# Altium project GateWay V1.2.PrjPCB
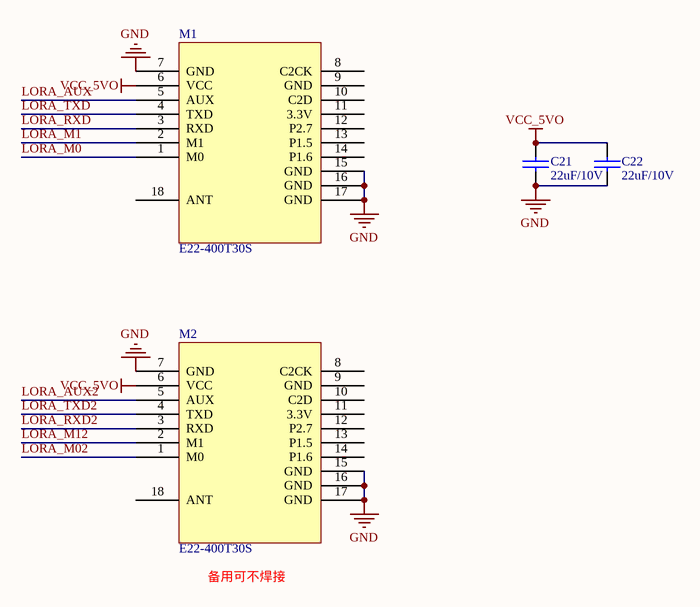
[diagram p0: LORA.SchDoc]
4 sheets, 92 parts. Net scope: global (net labels, ports and power ports of the same name join across sheets).
Board file: GateWay V1.2.PcbDoc
Sheets:
  LORA.SchDoc
  nbiot&gps.SchDoc
  POWER.SchDoc
  rs485.SchDoc

## Sheet LORA.SchDoc
size A4

### Parts
C21  22uF/10V  [1206C]
C22  22uF/10V  [1206C]
M1  E22-400T30S  [E22-400T30S]
M2  E22-400T30S  [E22-400T30S]

### Nets
GND: C21.2 C22.2 M1.7(GND) M1.15(GND) M1.16(GND) M1.17(GND) M2.7(GND) M2.15(GND) M2.16(GND) M2.17(GND)  [project net AGND]
VCC_5VO: C21.1 C22.1 M1.6(VCC) M2.6(VCC)  [project net VCC_5V]
LORA_AUX: M1.5(AUX)
LORA_AUX2: M2.5(AUX)
LORA_M0: M1.1(M0)
LORA_M1: M1.2(M1)
LORA_M02: M2.1(M0)
LORA_M12: M2.2(M1)
LORA_RXD: M1.3(RXD)
LORA_RXD2: M2.3(RXD)
LORA_TXD: M1.4(TXD)
LORA_TXD2: M2.4(TXD)

Not connected (* = marked no-connect by the designer): M1 8(C2CK) 9(GND) 10(C2D) 11(3.3V) 12(P2.7) 13(P1.5) 14(P1.6) 18(ANT); M2 8(C2CK) 9(GND) 10(C2D) 11(3.3V) 12(P2.7) 13(P1.5) 14(P1.6) 18(ANT)

### Notes on the sheet
- 备用可不焊接

### Library data of the parts
C21 C22 = CAP: Capacitor

## Sheet nbiot&gps.SchDoc
size A3
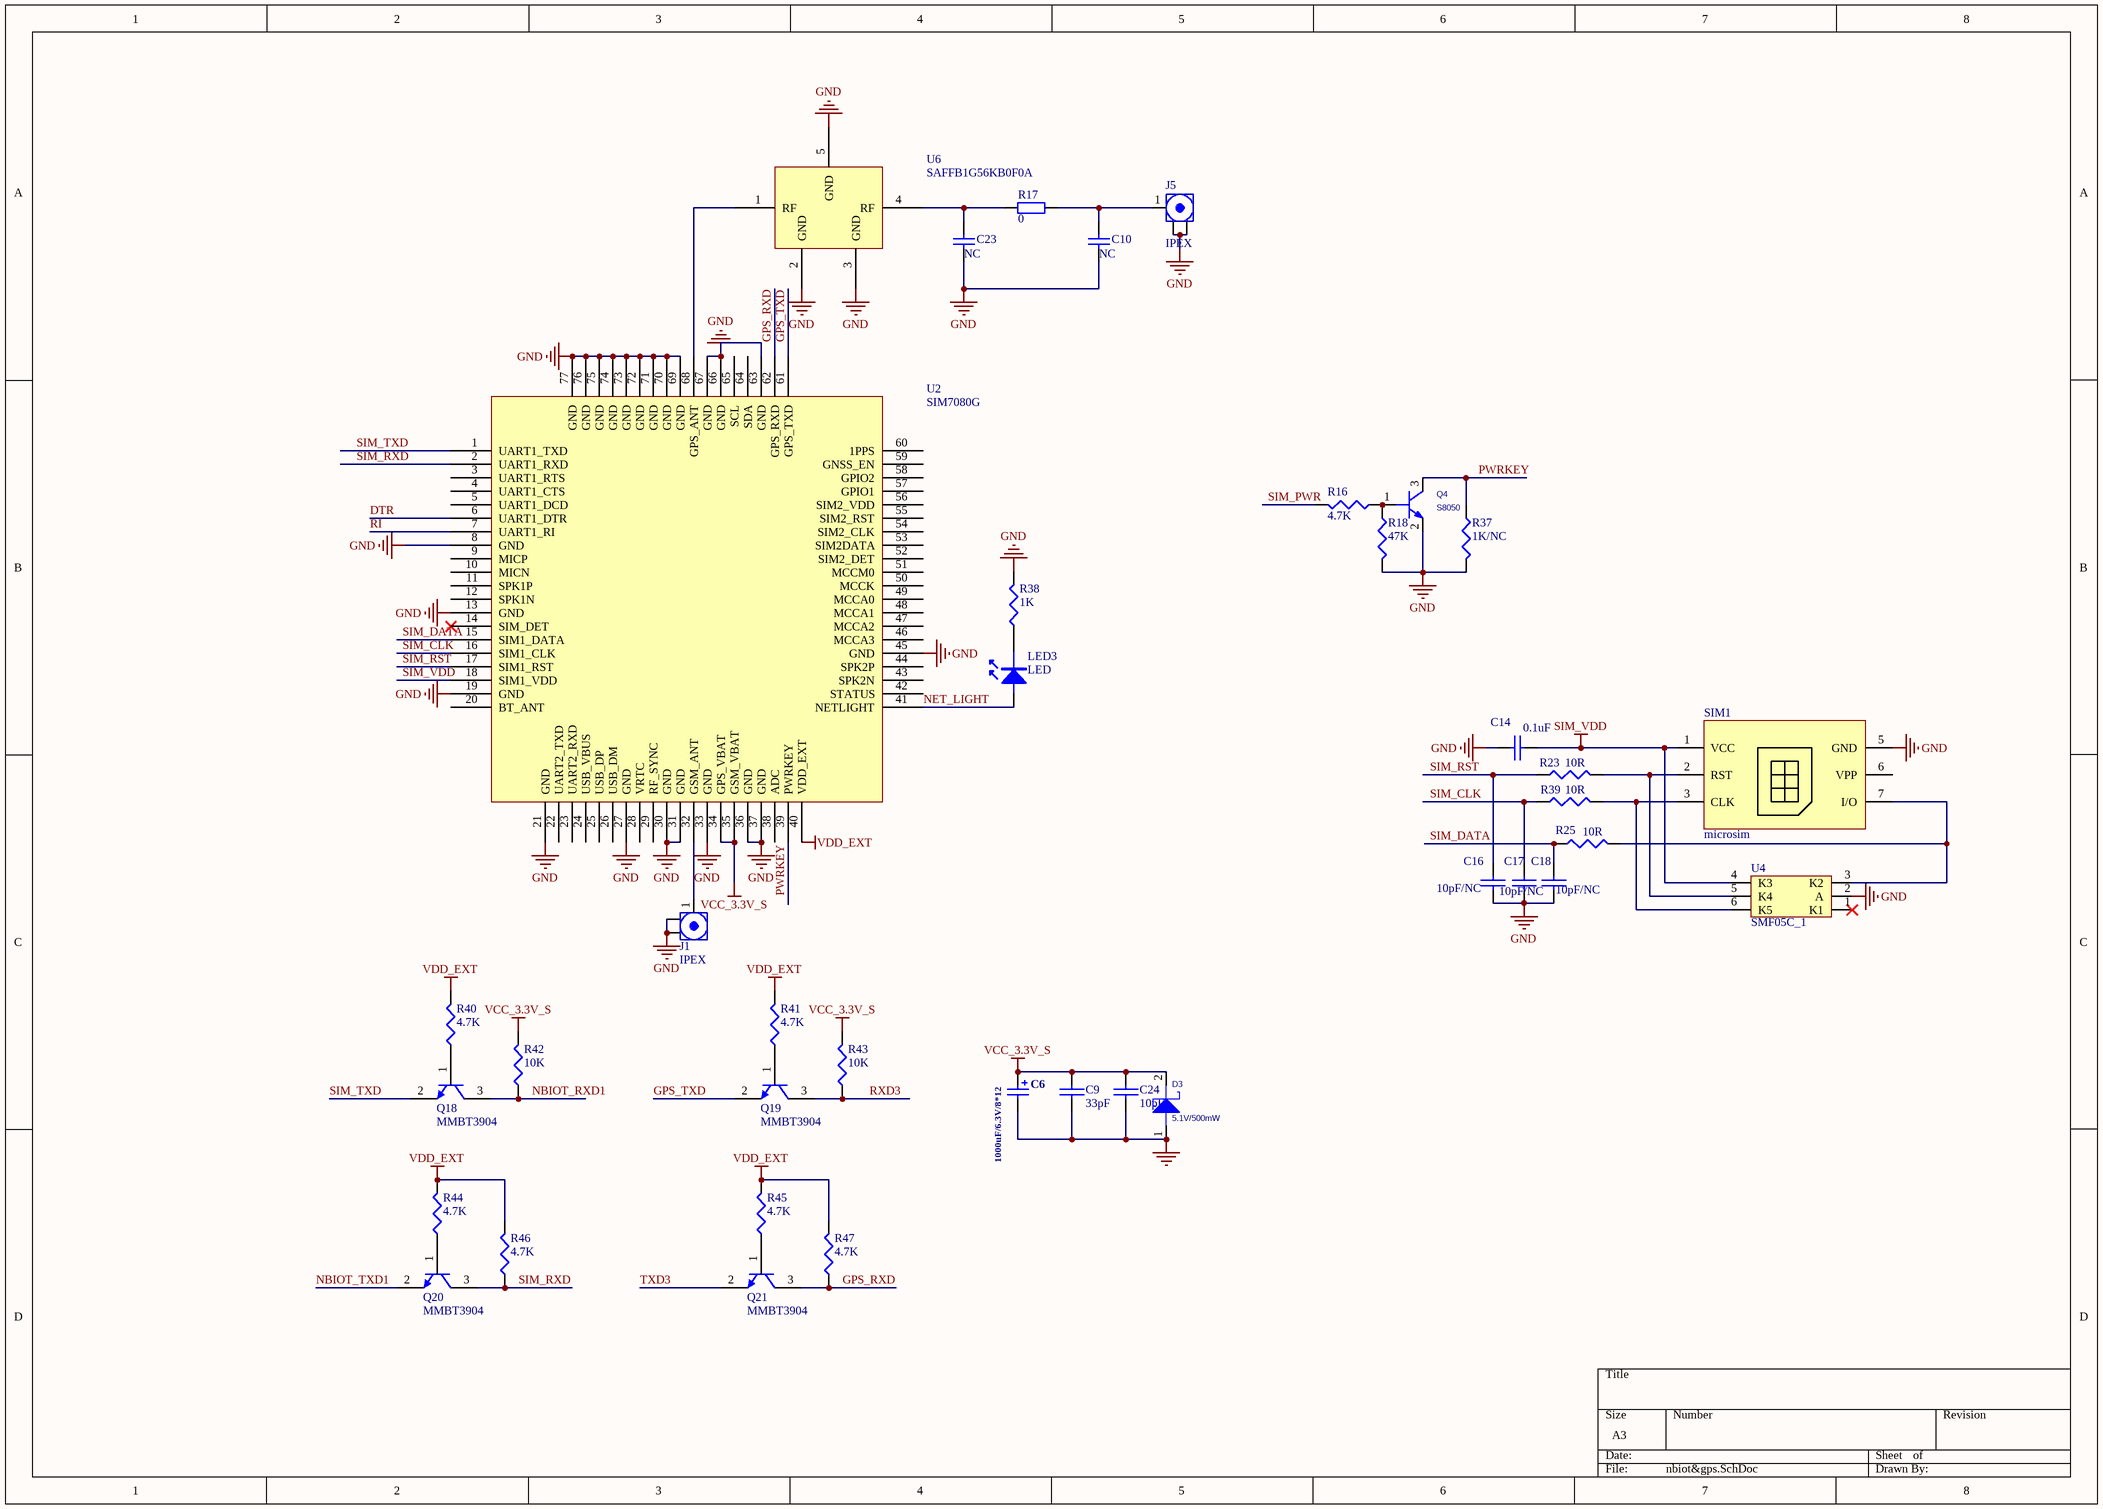
[diagram p1: nbiot&gps.SchDoc]

### Parts
C6  1000uF/6.3V/8*12  [8*12]
C9  33pF  [0603C]
C10  NC  [0603C]
C14  0.1uF  [0603C]
C16  10pF/NC  [0603C]
C17  10pF/NC  [0603C]
C18  10pF/NC  [0603C]
C23  NC  [0603C]
C24  10pF  [0603C]
D3  value 5.1V/500mW  [LL-34(D1206)]  (hidden comment: DIODE_SCHOTTKY_0)
J1  IPEX  [RF-UFL]
J5  IPEX  [RF-UFL]
LED3  LED  [0603LED]
Q4  S8050  [SOT23]
Q18  MMBT3904  [SOT23-3]
Q19  MMBT3904  [SOT23-3]
Q20  MMBT3904  [SOT23-3]
Q21  MMBT3904  [SOT23-3]
R16  4.7K  [0603R]
R17  0  [0603R]
R18  47K  [0603R]
R23  10R  [0603R]
R25  10R  [0603R]
R37  1K/NC  [0603R]
R38  1K  [0603R]
R39  10R  [0603R]
R40  4.7K  [0603R]
R41  4.7K  [0603R]
R42  10K  [0603R]
R43  10K  [0603R]
R44  4.7K  [0603R]
R45  4.7K  [0603R]
R46  4.7K  [0603R]
R47  4.7K  [0603R]
SIM1  microsim  [Nano SIM]
U2  SIM7080G  [SIM868]
U4  SMF05C_1  [SC70-6L]
U6  SAFFB1G56KB0F0A  [SAFFB1G56KB0F0A]

### Nets
GND: C6.2 C9.1 C10.2 C14.1 C16.1 C17.1 C18.1 C23.2 C24.1 D3.1 J1.2(Y) J5.2(Y) Q4.2(E) R18.2 R37.2 R38.2 SIM1.5(GND) U2.8(GND) U2.13(GND) U2.19(GND) U2.21(GND) U2.27(GND) U2.30(GND) U2.31(GND) U2.33(GND) U2.36(GND) U2.37(GND) U2.45(GND) U2.63(GND) U2.66(GND) U2.67(GND) U2.69(GND) U2.70(GND) U2.71(GND) U2.72(GND) U2.73(GND) U2.74(GND) U2.75(GND) U2.76(GND) U2.77(GND) U4.2(A) U6.2(GND) U6.3(GND) U6.5(GND)  [project net AGND]
SIM_VDD: C14.2 SIM1.1(VCC) U2.18(SIM1_VDD) U4.4(K3)
VCC_3.3V_S: C6.1 C9.2 C24.2 D3.2 R42.2 R43.2 U2.34(GPS_VBAT) U2.35(GSM_VBAT)
VDD_EXT: R40.2 R41.2 R44.2 R45.2 R46.2 R47.2 U2.40(VDD_EXT)
DTR: U2.6(UART1_DTR)
GPS_RXD: Q21.3(C) R47.1 U2.62(GPS_RXD)
GPS_TXD: Q19.2(E) U2.61(GPS_TXD)
NBIOT_RXD1: Q18.3(C) R42.1
NBIOT_TXD1: Q20.2(E)
NET_LIGHT: LED3.1 U2.41(NETLIGHT)
PWRKEY: Q4.3(C) R37.1 U2.39(PWRKEY)
RI: U2.7(UART1_RI)
RXD3: Q19.3(C) R43.1
SIM_CLK: C17.2 R39.1 U2.16(SIM1_CLK)
SIM_DATA: C18.2 R25.1 U2.15(SIM1_DATA)
SIM_PWR: R16.2
SIM_RST: C16.2 R23.1 U2.17(SIM1_RST)
SIM_RXD: Q20.3(C) R46.1 U2.2(UART1_RXD)
SIM_TXD: Q18.2(E) U2.1(UART1_TXD)
TXD3: Q21.2(E)
NetC10_1: C10.1 J5.1(X) R17.2
NetC23_1: C23.1 R17.1 U6.4(RF)
NetJ1_1: J1.1(X) U2.32(GSM_ANT)
NetLED3_2: LED3.2 R38.1
NetQ4_1: Q4.1(B) R16.1 R18.1
NetQ18_1: Q18.1(B) R40.1
NetQ19_1: Q19.1(B) R41.1
NetQ20_1: Q20.1(B) R44.1
NetQ21_1: Q21.1(B) R45.1
NetR23_2: R23.2 SIM1.2(RST) U4.5(K4)
NetR25_2: R25.2 SIM1.7(I/O) U4.3(K2)
NetR39_2: R39.2 SIM1.3(CLK) U4.6(K5)
NetU2_68: U2.68(GPS_ANT) U6.1(RF)

Not connected (* = marked no-connect by the designer): SIM1 6(VPP); U2 3(UART1_RTS) 4(UART1_CTS) 5(UART1_DCD) 9(MICP) 10(MICN) 11(SPK1P) 12(SPK1N) 14(SIM_DET)* 20(BT_ANT) 22(UART2_TXD) 23(UART2_RXD) 24(USB_VBUS) 25(USB_DP) 26(USB_DM) 28(VRTC) 29(RF_SYNC) 38(ADC) 42(STATUS) 43(SPK2N) 44(SPK2P) 46(MCCA3) 47(MCCA2) 48(MCCA1) 49(MCCA0) 50(MCCK) 51(MCCM0) 52(SIM2_DET) 53(SIM2DATA) 54(SIM2_CLK) 55(SIM2_RST) 56(SIM2_VDD) 57(GPIO1) 58(GPIO2) 59(GNSS_EN) 60(1PPS) 64(SDA) 65(SCL); U4 1(K1)*

### Library data of the parts
C6 = Cap Pol3: Polarized Capacitor (Surface Mount); PackageReference: C10*10.2
C9 C14 C16-C18 C24 = CAP: Capacitor
C10 C23 = Cap: Capacitor; Value: 0.1uF/10V; Published: 8-Jun-2000; LatestRevisionDate: 17-Jul-2002; LatestRevisionNote: Re-released for DXP Platform.; PackageReference: RAD-0.3; Publisher: Altium Limited
D3 = DIODE_SCHOTTKY_0: PCB DECAL: DO_214AC; Source_Path: E:\AIH\WORK\A\LIBRARY1.OLB
J1 J5 = ANT
Q4 = 2N1069_1: PspiceTemplate: Q^@REFDES %C %B %E
Q18-Q21 = NPN
R16 R18 R23 R25 R37-R47 = RES1: P: 1/8W
R17 = Res2: Resistor; Published: 8-Jun-2000; LatestRevisionDate: 17-Jul-2002; LatestRevisionNote: Re-released for DXP Platform.; PackageReference: AXIAL-0.4; Publisher: Altium Limited; Value: 0
U2 = SIM868E/SIM868
U4 = SMF05C_1: TVS
U6 = SAFFB1G56KBOFA

## Sheet POWER.SchDoc
size A3
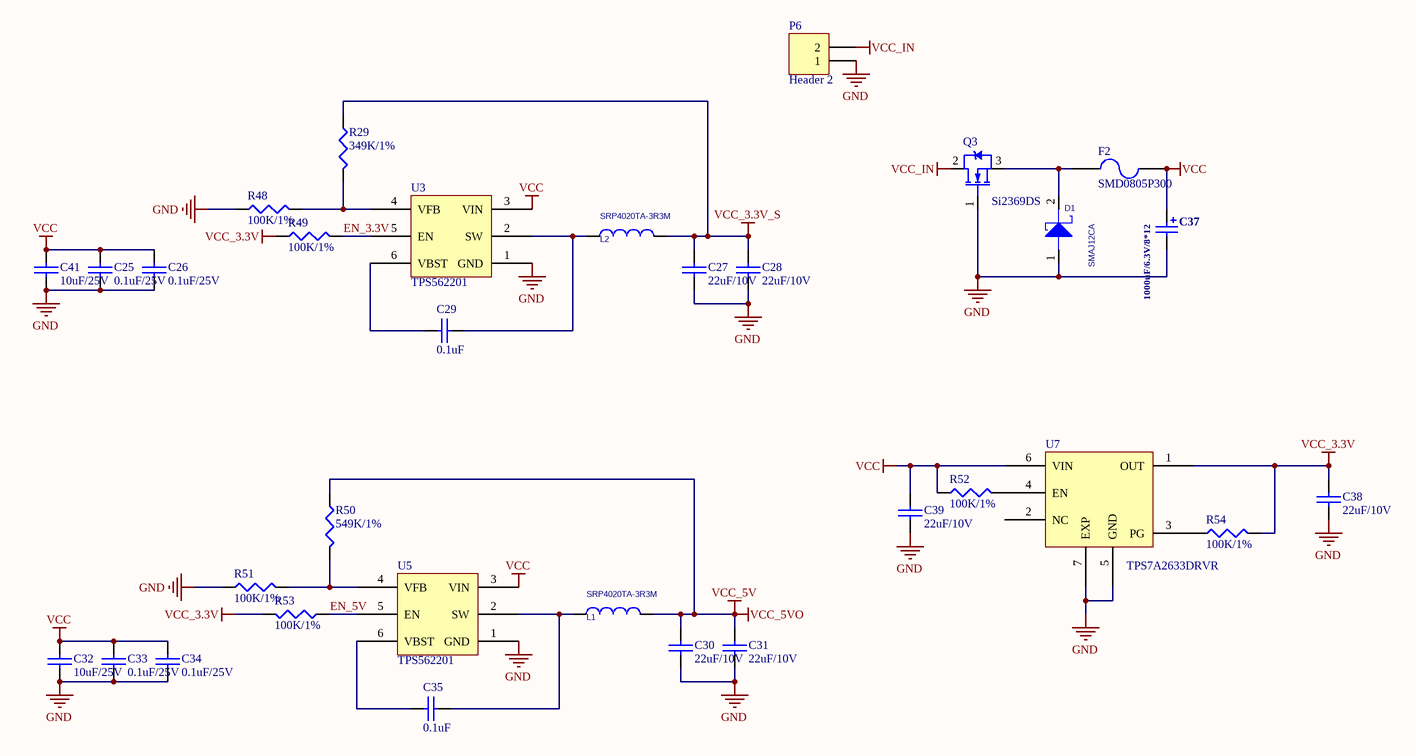
[diagram p2: POWER.SchDoc]

### Parts
C25  0.1uF/25V  [0603C]
C26  0.1uF/25V  [0603C]
C27  22uF/10V  [1206C]
C28  22uF/10V  [1206C]
C29  0.1uF  [0603C]
C30  22uF/10V  [1206C]
C31  22uF/10V  [1206C]
C32  10uF/25V  [0603C]
C33  0.1uF/25V  [0603C]
C34  0.1uF/25V  [0603C]
C35  0.1uF  [0603C]
C37  1000uF/6.3V/8*12  [8*12]
C38  22uF/10V  [1206C]
C39  22uF/10V  [1206C]
C41  10uF/25V  [0603C]
D1  SMAJ12CA  [SMA]
F2  SMD0805P300  [0805R]
L1  SRP4020TA-3R3M  [CD_4*4]
L2  SRP4020TA-3R3M  [CD_4*4]
P6  Header 2  [2X2.54MMZ]
Q3  Si2369DS  [sot23-3]
R29  349K/1%  [0603R]
R48  100K/1%  [0603R]
R49  100K/1%  [0603R]
R50  549K/1%  [0603R]
R51  100K/1%  [0603R]
R52  100K/1%  [0603R]
R53  100K/1%  [0603R]
R54  100K/1%  [0603R]
U3  TPS562201  [SOT-23-6]
U5  TPS562201  [SOT-23-6]
U7  TPS7A2633DRVR  [WSON-6]

### Nets
GND: C25.1 C26.1 C27.2 C28.2 C30.2 C31.2 C32.1 C33.1 C34.1 C37.2 C38.2 C39.2 C41.1 D1.1 P6.1 Q3.1(G) R48.1 R51.1 U3.1(GND) U5.1(GND) U7.5(GND) U7.7(EXP)  [project net AGND]
VCC: C25.2 C26.2 C32.2 C33.2 C34.2 C37.1 C39.1 C41.2 F2.2 R52.1 U3.3(VIN) U5.3(VIN) U7.6(VIN)
VCC_3.3V: C38.1 R49.1 R53.2 R54.2 U7.1(OUT)
VCC_3.3V_S: C27.1 C28.1 L2.2 R29.1
VCC_5V: C30.1 C31.1 L1.2 R50.1  [also labelled VCC_5VO]
VCC_IN: P6.2 Q3.2(D)
EN_3.3V: R49.2 U3.5(EN)
EN_5V: R53.1 U5.5(EN)
NetC29_1: C29.1 L2.1 U3.2(SW)
NetC29_2: C29.2 U3.6(VBST)
NetC35_1: C35.1 L1.1 U5.2(SW)
NetC35_2: C35.2 U5.6(VBST)
NetD1_2: D1.2 F2.1 Q3.3(S)
NetR29_2: R29.2 R48.2 U3.4(VFB)
NetR50_2: R50.2 R51.2 U5.4(VFB)
NetR52_2: R52.2 U7.4(EN)
NetR54_1: R54.1 U7.3(PG)

Not connected (* = marked no-connect by the designer): U7 2(NC)

### Library data of the parts
C25-C35 C38 C39 C41 = CAP: Capacitor
C37 = Cap Pol3: Polarized Capacitor (Surface Mount); PackageReference: C10*10.2
D1 = DIODE_SCHOTTKY_0: as D3 on sheet nbiot&gps; Value: SMAJ12CA
F2 = Fuse 2: Fuse; Published: 8-Jun-2000; LatestRevisionDate: 17-Jul-2002; LatestRevisionNote: Re-released for DXP Platform.; PackageReference: PIN-W2/E2.8; Publisher: Altium Limited
L1 L2 = INDUCTOR_1
P6 = Header 2: Header, 2-Pin; LatestRevisionDate: 17-Jul-2002; LatestRevisionNote: Re-released for DXP Platform.; Publisher: Altium Limited
Q3 = NCE4060K: NMOSFET
R29 R48-R54 = RES1: P: 1/8W

## Sheet rs485.SchDoc
size A4
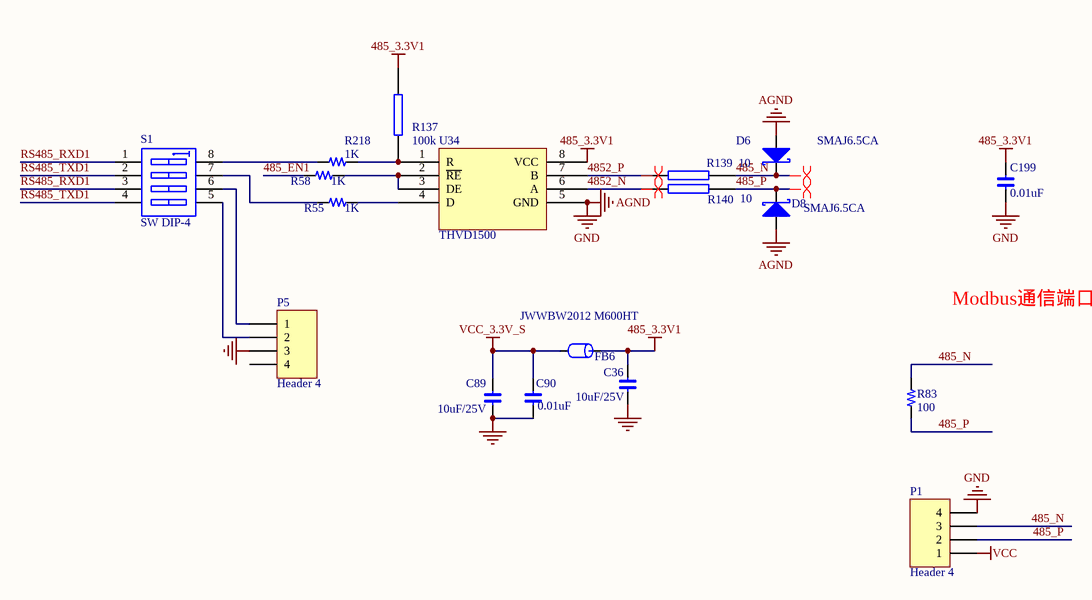
[diagram p3: rs485.SchDoc]

### Parts
C36  10uF/25V  [0603C]
C89  10uF/25V  [0603C]
C90  0.01uF  [0603C]
C199  0.01uF  [0603C]
D6  SMAJ6.5CA  [SMA]
D8  SMAJ6.5CA  [SMA]
FB6  JWWBW2012 M600HT  [0805CZ]
P1  Header 4  [4X2.54MMZ]
P5  Header 4  [4X2.54MMZ]
R55  1K  [0603R]
R58  1K  [0603R]
R83  100  [0603R]
R137  100k  [0603R]
R139  10  [1206R]
R140  10  [1206R]
R218  1K  [0603R]
S1  SW DIP-4  [SW_SMT_8]
U34  THVD1500  [so-8]

### Nets
485_3.3V1: C36.2 C199.2 FB6.1 R137.2 U34.8(VCC)
AGND: C36.1 C89.1 C90.1 C199.1 D6.1(A) D8.1(A) P1.4 P5.3 U34.5(GND)  [also labelled GND]
VCC: P1.1
VCC_3.3V_S: C89.2 C90.2 FB6.2
485_EN1: R58.2
485_N: D6.2(K) P1.3 R83.2 R139.1
485_P: D8.2(K) P1.2 R83.1 R140.1
4852_N: R140.2 U34.6(A)
4852_P: R139.2 U34.7(B)
RS485_RXD1: S1.1(A1) S1.3(A3)
RS485_TXD1: S1.2(A2) S1.4(A4)
NetP5_1: P5.1 S1.6(B3)
NetP5_2: P5.2 S1.5(B4)
NetR55_1: R55.1 U34.4(D)
NetR55_2: R55.2 S1.7(B2)
NetR58_1: R58.1 U34.2(~{RE}) U34.3(DE)
NetR137_1: R137.1 R218.1 U34.1(R)
NetR218_2: R218.2 S1.8(B1)

Not connected (* = marked no-connect by the designer): P5 4

### Layout directives
differential pair: 485_N, 485_P, 4852_N, 4852_P

### Notes on the sheet
- Modbus通信端口

### Library data of the parts
C36 C89 C90 C199 = C
D6 D8 = DIODE S: Schottky Diode
FB6 = FB: Part Field 1: 磁珠/0603/1K ohm/100MHz; FB: BLM18BD102SN1(muRata); Text Field1: FB
P1 P5 = Header 4: Header, 4-Pin; LatestRevisionDate: 17-Jul-2002; LatestRevisionNote: Re-released for DXP Platform.; Publisher: Altium Limited
R55 R58 R83 R218 = R
R137 R139 R140 = RES2
S1 = SW DIP-4: DIP Switch, 4 Position, SPST; Published: 24-Mar-1999; LatestRevisionDate: 29-May-2009; LatestRevisionNote: IPC-7351 Footprint Added.; PackageVersion: Dec-2002; PackageReference: SO8; Publisher: Altium Limited; PackageDescription: 8-Pin Small Outline Integrated Circuit 1.27 mm Pitch; Code_JEDEC: MS-012-AA; Code_IPC: SOIC127P600-8
U34 = SN65HVD06D

## Nets that join several sheets
AGND: LORA (10 pins), nbiot&gps (44 pins), POWER (22 pins), rs485 (9 pins)
VCC: POWER (13 pins), rs485 (P1.1)
VCC_3.3V_S: nbiot&gps (8 pins), POWER (C27.1 C28.1 L2.2 R29.1), rs485 (C89.2 C90.2 FB6.2)
VCC_5V: LORA (C21.1 C22.1 M1.6 M2.6), POWER (C30.1 C31.1 L1.2 R50.1)